# EAGLE design メイン回路２ (EAGLE 9.6.2)
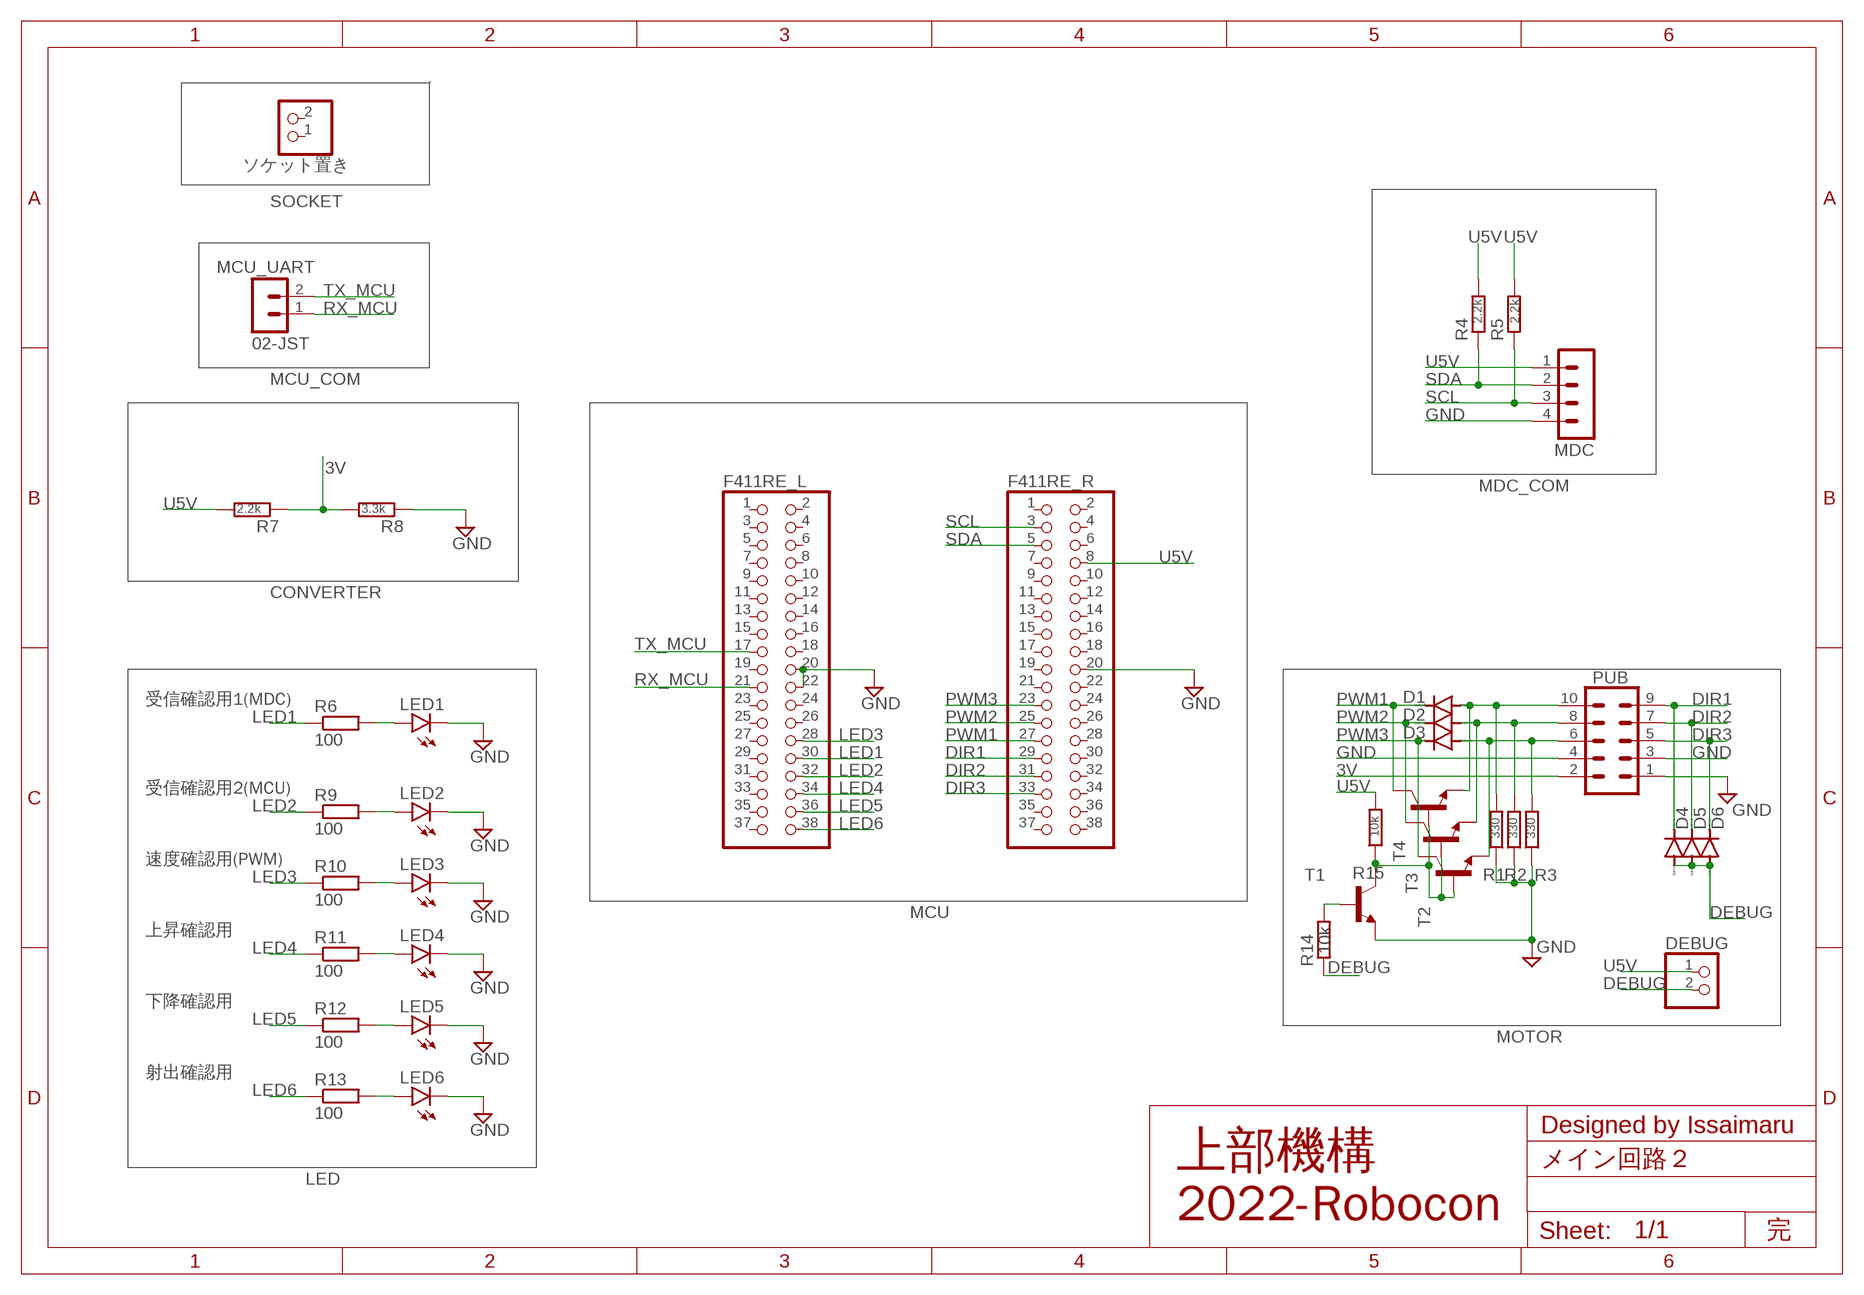
[diagram p0: schematic, sheet 1]

## Parts
D1  1N4004  [DO41-10]
D2  1N4004  [DO41-10]
D3  1N4004  [DO41-10]
D4  1N4004  [DO41-10]
D5  1N4004  [DO41-10]
D6  1N4004  [DO41-10]
DEBUG  PINHD-1X2  [1X02]
F411RE_L  PINHD-2X19  [2X19]
F411RE_R  PINHD-2X19  [2X19]
LED1  LED5MM  [LED5MM]
LED2  LED5MM  [LED5MM]
LED3  LED5MM  [LED5MM]
LED4  LED5MM  [LED5MM]
LED5  LED5MM  [LED5MM]
LED6  LED5MM  [LED5MM]
MCU_UART  02-JST  [B2B-XH]
MDC  04-JST  [B4B-XH]
PUB  ML10  [ML10]
R1  330  R-EU_0204/7  [0204/7]
R2  330  R-EU_0204/7  [0204/7]
R3  330  R-EU_0204/7  [0204/7]
R4  2.2k  R-EU_0204/7  [0204/7]
R5  2.2k  R-EU_0204/7  [0204/7]
R6  100  R-EU_0204/7  [0204/7]
R7  2.2k  R-EU_0204/7  [0204/7]
R8  3.3k  R-EU_0204/7  [0204/7]
R9  100  R-EU_0204/7  [0204/7]
R10  100  R-EU_0204/7  [0204/7]
R11  100  R-EU_0204/7  [0204/7]
R12  100  R-EU_0204/7  [0204/7]
R13  100  R-EU_0204/7  [0204/7]
R14  10k  R-EU_0204/7  [0204/7]
R15  10k  R-EU_0204/7  [0204/7]
T1  一般的なトランジスタ  [TO92-CEB]
T2  一般的なトランジスタ  [TO92-CEB]
T3  一般的なトランジスタ  [TO92-CEB]
T4  一般的なトランジスタ  [TO92-CEB]
ソケット置き  PINHD-1X2  [1X02]

## Nets
3V: PUB.2 R7.1 R8.2
DEBUG: D4.A D5.A D6.A DEBUG.2 R14.1
DIR1: D4.C F411RE_R.29 PUB.9
DIR2: D5.C F411RE_R.31 PUB.7
DIR3: D6.C F411RE_R.33 PUB.5
GND: F411RE_L.20 F411RE_L.22 F411RE_R.20 LED1.K(C) LED2.K(C) LED3.K(C) LED4.K(C) LED5.K(C) LED6.K(C) MDC.4 PUB.1 PUB.3 PUB.4 R1.1 R2.1 R3.1 R8.1 T1.E
LED1: F411RE_L.30 R6.1
LED2: F411RE_L.32 R9.1
LED3: F411RE_L.28 R10.1
LED4: F411RE_L.34 R11.1
LED5: F411RE_L.36 R12.1
LED6: F411RE_L.38 R13.1
N$1: LED2.A R9.2
N$2: LED1.A R6.2
N$3: LED3.A R10.2
N$4: LED4.A R11.2
N$5: LED5.A R12.2
N$6: LED6.A R13.2
N$7: R14.2 T1.B
N$8: D1.A PUB.10 R1.2 T4.E
N$9: D2.A PUB.8 R2.2 T3.E
N$Q0: D3.A PUB.6 R3.2 T2.E
PWM1: D1.C F411RE_R.27 T4.C
PWM2: D2.C F411RE_R.25 T3.C
PWM3: D3.C F411RE_R.23 T2.C
RX_MCU: F411RE_L.21 MCU_UART.1
SCL: F411RE_R.3 MDC.3 R5.1
SDA: F411RE_R.5 MDC.2 R4.1
TX_MCU: F411RE_L.17 MCU_UART.2
U5V: DEBUG.1 F411RE_R.8 MDC.1 R4.2 R5.2 R7.2 R15.2
ZM: R15.1 T1.C T2.B T3.B T4.B
Unconnected: F411RE_L.1 F411RE_L.2 F411RE_L.3 F411RE_L.4 F411RE_L.5 F411RE_L.6 F411RE_L.7 F411RE_L.8 F411RE_L.9 F411RE_L.10 F411RE_L.11 F411RE_L.12 F411RE_L.13 F411RE_L.14 F411RE_L.15 F411RE_L.16 F411RE_L.18 F411RE_L.19 F411RE_L.23 F411RE_L.24 F411RE_L.25 F411RE_L.26 F411RE_L.27 F411RE_L.29 F411RE_L.31 F411RE_L.33 F411RE_L.35 F411RE_L.37 F411RE_R.1 F411RE_R.2 F411RE_R.4 F411RE_R.6 F411RE_R.7 F411RE_R.9 F411RE_R.10 F411RE_R.11 F411RE_R.12 F411RE_R.13 F411RE_R.14 F411RE_R.15 F411RE_R.16 F411RE_R.17 F411RE_R.18 F411RE_R.19 F411RE_R.21 F411RE_R.22 F411RE_R.24 F411RE_R.26 F411RE_R.28 F411RE_R.30 F411RE_R.32 F411RE_R.34 F411RE_R.35 F411RE_R.36 F411RE_R.37 F411RE_R.38 ソケット置き.1 ソケット置き.2

## Notes on the sheet
- SOCKET
- MCU_COM
- MDC_COM
- CONVERTER
- 受信確認用1(MDC)
- 受信確認用2(MCU)
- 速度確認用(PWM)
- MCU
- 上昇確認用
- 下降確認用
- MOTOR
- 射出確認用
- Designed by Issaimaru
- LED
- 上部機構
  2022-Robocon
- 完

## Library data of the parts
D1-D6 = diode:1N4004: DIODE general purpose rectifier, 1 A
DEBUG ソケット置き = pinhead:PINHD-1X2: PIN HEADER
F411RE_L F411RE_R = pinhead:PINHD-2X19: PIN HEADER
LED1-LED6 = led:LED: LED OSRAM: - CHIPLED LG R971, LG N971, LY N971, LG Q971, LY Q971, LO R971, LY R971 LH N974, LH R974 LS Q976, LO Q976, LY Q976 LO Q996 - Hyper CHIPLED LW Q18S LB Q993, LB Q99A, LB R99A - SideLED LS A670, LO A670, LY A670, LG A670, LP A670 LB A673, LV A673, LT A673, LW A673 LH A674 LY A675 LS A676, LA A676, LO A676, LY A676, LW A676 LS A679, LY A679, LG A679 - Hyper Micro SIDELED® LS Y876, LA Y876, LO Y876, LY Y876 LT Y87S - SmartLED LW L88C, LW L88S LB L89C, LB L89S, LG L890 LS L89K, LO L89K, LY L89K LS L896, LA L896, LO L896, LY L896 - TOPLED LS T670, LO T670, LY T670, LG T670, LP T670 LSG T670, LSP T670, LSY T670, LOP T670, LYG T670 LG T671, LOG T671, LSG T671 LB T673, LV T673, LT T673, LW T673 LH T674 LS T676, LA T676, LO T676, LY T676, LB T676, LH T676, LSB T676, LW T676 LB T67C, LV T67C, LT T67C, LS T67K, LO T67K, LY T67K, LW E67C LS E67B, LA E67B, LO E67B, LY E67B, LB E67C, LV E67C, LT E67C LW T67C LS T679, LY T679, LG T679 LS T770, LO T770, LY T770, LG T770, LP T770 LB T773, LV T773, LT T773, LW T773 LH T774 LS E675, LA E675, LY E675, LS T675 LS T776, LA T776, LO T776, LY T776, LB T776 LHGB T686 LT T68C, LB T68C - Hyper Mini TOPLED® LB M676 - Mini TOPLED Santana® LG M470 LS M47K, LO M47K, LY M47K Source: http://www.osram.convergy.de LUXEON: - LUMILED® LXK2-PW12-R00, LXK2-PW12-S00, LXK2-PW14-U00, LXK2-PW14-V00 LXK2-PM12-R00, LXK2-PM12-S00, LXK2-PM14-U00 LXK2-PE12-Q00, LXK2-PE12-R00, LXK2-PE12-S00, LXK2-PE14-T00, LXK2-PE14-U00 LXK2-PB12-K00, LXK2-PB12-L00, LXK2-PB12-M00, LXK2-PB14-N00, LXK2-PB14-P00, LXK2-PB14-Q00 LXK2-PR12-L00, LXK2-PR12-M00, LXK2-PR14-Q00, LXK2-PR14-R00 LXK2-PD12-Q00, LXK2-PD12-R00, LXK2-PD12-S00 LXK2-PH12-R00, LXK2-PH12-S00 LXK2-PL12-P00, LXK2-PL12-Q00, LXK2-PL12-R00 Source: www.luxeon.com KINGBRIGHT: KA-3528ASYC Source: www.kingbright.com
MCU_UART = con-jst-xh (1):02-JST: JST CONNECTOR
MDC = con-jst-xh:04-JST: JST CONNECTOR
PUB = con-ml:ML10: HARTING; OC_FARNELL: unknown; OC_NEWARK: unknown
R1-R15 = rcl:R-EU_: RESISTOR, European symbol; SPICEPREFIX: R
T1-T4 = 一般的なトランジスタ:一般的なトランジスタ

## Board
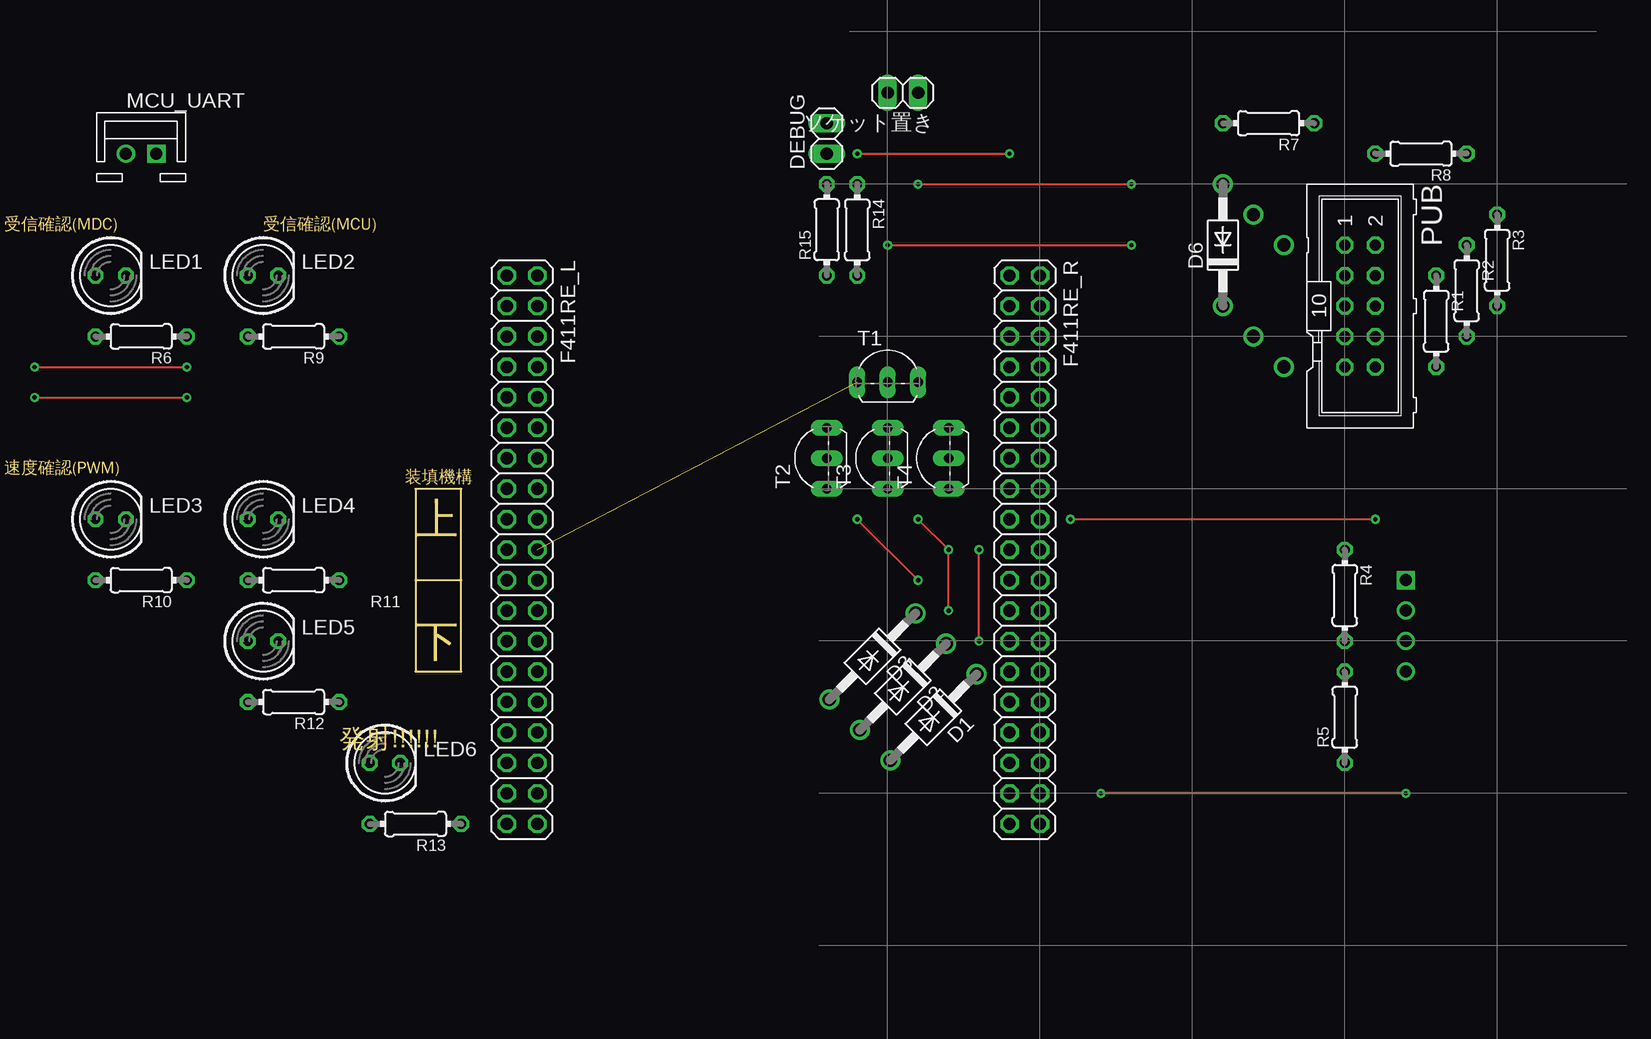
[diagram p1: board, top side]
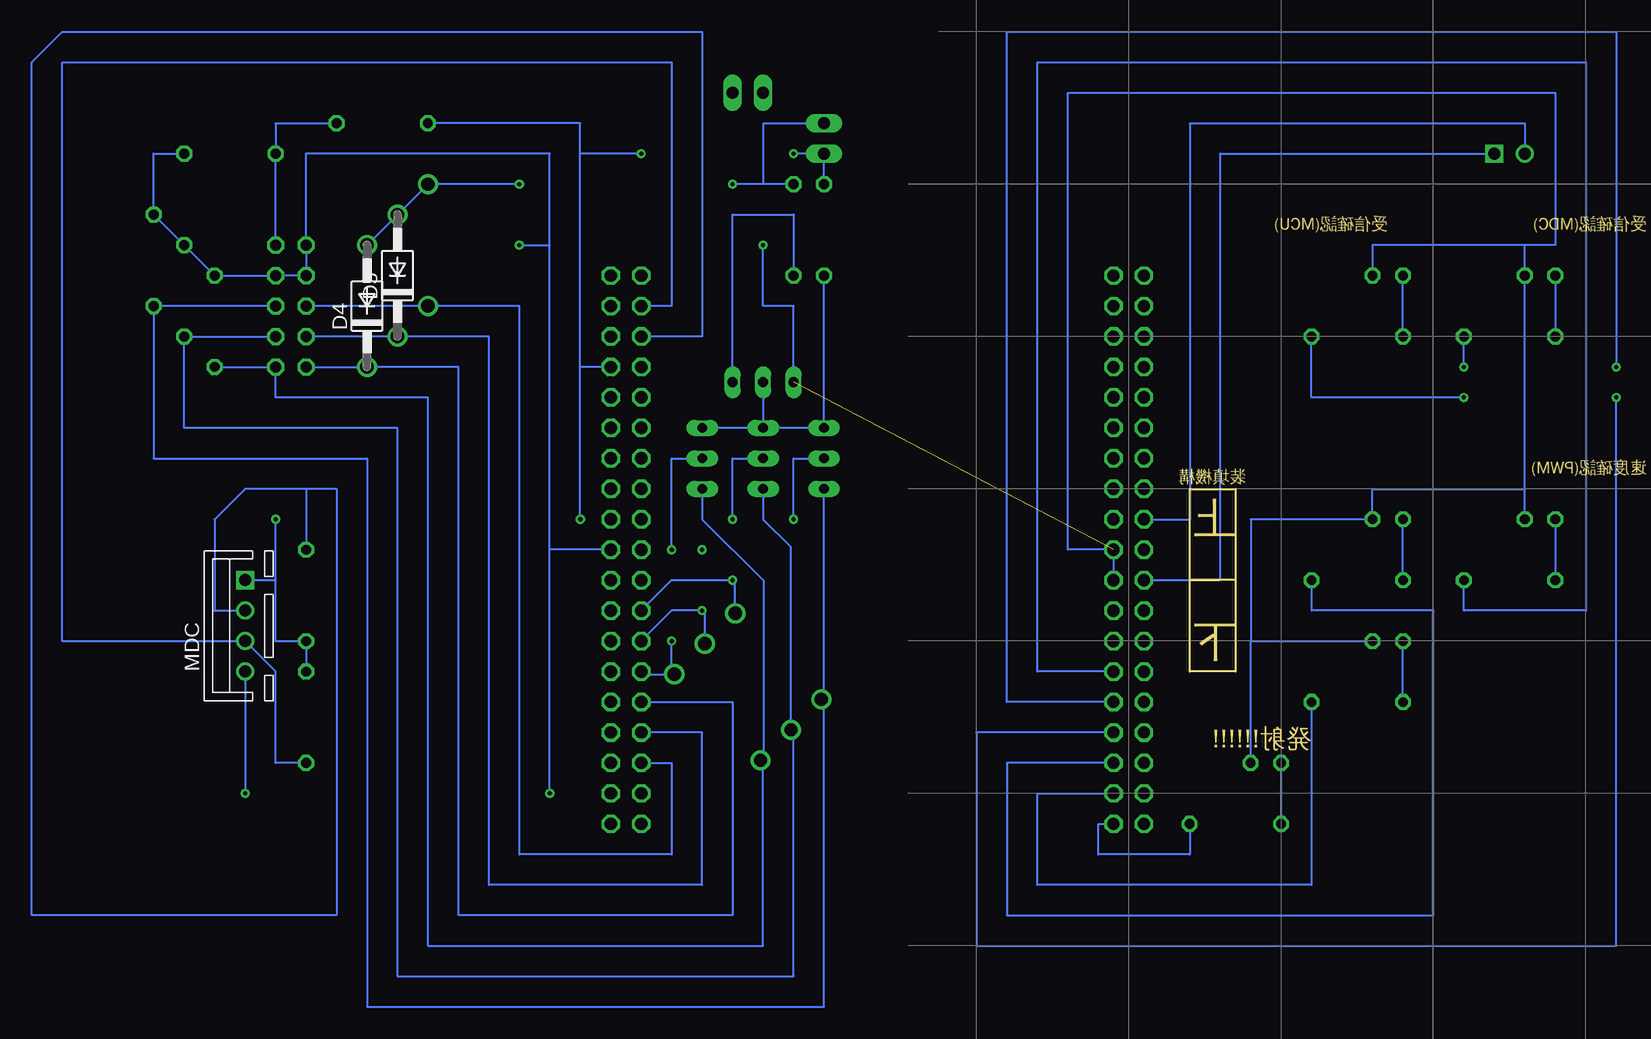
[diagram p2: board, bottom side, seen from below]

No outline drawn. Coordinates in mm, seen from the top.
Copper layers (1*16): Top 0.035mm / dielectric 1.5mm / Bottom 0.035mm
Design rules "default": minimum track width 6mil, minimum drill 0.35mm, track to track 6mil, track to pad 6mil, pad to pad 6mil, via to via 6mil, smd to smd 6mil, copper to edge 40mil, drill to drill 6mil, minimum pad ring 10mil, minimum via ring 8mil, stop-mask expansion 4mil, vias tented up to drill 0mil, thermal gap 10mil
Milling: 7 lines

### Footprints (pad centres in the part's own frame; a part is rotated, then mirrored left to right if it is on the bottom)
DO41-10 = drill 1.118: A 5.08,0; C -5.08,0
1X02 = drill 1.016 long: 1 -1.27,0; 2 1.27,0
2X19 = drill 1.016 octagon: 1 -22.86,-1.27; 2 -22.86,1.27; 3 -20.32,-1.27; 4 -20.32,1.27; 5 -17.78,-1.27; 6 -17.78,1.27; 7 -15.24,-1.27; 8 -15.24,1.27; 9 -12.7,-1.27; 10 -12.7,1.27; 11 -10.16,-1.27; 12 -10.16,1.27; 13 -7.62,-1.27; 14 -7.62,1.27; 15 -5.08,-1.27; 16 -5.08,1.27; 17 -2.54,-1.27; 18 -2.54,1.27; 19 0,-1.27; 20 0,1.27; 21 2.54,-1.27; 22 2.54,1.27; 23 5.08,-1.27; 24 5.08,1.27; 25 7.62,-1.27; 26 7.62,1.27; 27 10.16,-1.27; 28 10.16,1.27; 29 12.7,-1.27; 30 12.7,1.27; 31 15.24,-1.27; 32 15.24,1.27; 33 17.78,-1.27; 34 17.78,1.27; 35 20.32,-1.27; 36 20.32,1.27; 37 22.86,-1.27; 38 22.86,1.27
LED5MM = drill 0.813 octagon: A -1.27,0; K 1.27,0
B2B-XH = drill 1 square: 1 1.27,0 | drill 1: 2 -1.27,0
B4B-XH = drill 1 square: 1 3.81,0 | drill 1: 2 1.27,0; 3 -1.27,0; 4 -3.81,0
ML10 = drill 0.914 octagon: 1 -5.08,-1.27; 2 -5.08,1.27; 3 -2.54,-1.27; 4 -2.54,1.27; 5 0,-1.27; 6 0,1.27; 7 2.54,-1.27; 8 2.54,1.27; 9 5.08,-1.27; 10 5.08,1.27
0204/7 = drill 0.813 octagon: 1 -3.81,0; 2 3.81,0
TO92-CEB = drill 0.813 long: B 2.54,0; C 0,0; E -2.54,0

### Placement (x,y rotation side)
D1  72.39,12.7 225 top
D2  69.85,15.24 225 top
D3  67.31,17.78 225 top
D4  101.6,46.99 90 bottom
D5  99.06,49.53 90 bottom
D6  96.52,52.07 90 top
DEBUG  63.5,60.96 90 top
F411RE_L  38.1,26.67 270 top
F411RE_R  80.01,26.67 270 top
LED1  3.81,49.53 0 top
LED2  16.51,49.53 0 top
LED3  3.81,29.21 0 top
LED4  16.51,29.21 0 top
LED5  16.51,19.05 0 top
LED6  26.67,8.89 0 top
MCU_UART  6.35,59.69 0 top
MDC  111.76,20.32 90 bottom
PUB  107.95,46.99 270 top
R1  114.3,45.72 270 top
R2  116.84,48.26 270 top
R3  119.38,50.8 270 top
R4  106.68,22.86 270 top
R5  106.68,12.7 90 top
R6  6.35,44.45 180 top
R7  100.33,62.23 180 top
R8  113.03,59.69 180 top
R9  19.05,44.45 180 top
R10  6.35,24.13 180 top
R11  19.05,24.13 180 top
R12  19.05,13.97 180 top
R13  29.21,3.81 180 top
R14  66.04,53.34 270 top
R15  63.5,53.34 90 top
T1  68.58,40.64 0 top
T2  63.5,34.29 90 top
T3  68.58,34.29 90 top
T4  73.66,34.29 90 top
U$2  [TYPE.B]  132.08,-19.05 90 top
U$3  [TYPE.B]  -12.7,-19.05 90 bottom
ソケット置き  69.85,64.77 180 top

### Tracks (layer width: path | path; a pad name or v marks a point on that pad's centre or on a via)
3V
  Bottom 0.152: R7.1 109.22,62.23 R8.2 PUB.2
DEBUG  (via drill 0.35)
  Top 0.152: v71.12,57.15 v88.9,57.15
  Bottom 0.152: D4.A D5.A D6.A v88.9,57.15 | DEBUG.2 68.58,62.23 68.58,57.15 R14.1 v71.12,57.15
DIR1
  Bottom 0.152: F411RE_R.29 71.12,13.97 71.12,-3.81 93.98,-3.81 93.98,41.91 D4.C PUB.9
DIR2
  Bottom 0.152: F411RE_R.31 73.66,11.43 73.66,-1.27 91.44,-1.27 91.44,44.45 D5.C PUB.7
DIR3
  Bottom 0.152: F411RE_R.33 76.2,8.89 76.2,1.27 88.9,1.27 88.9,46.99 D6.C PUB.5
GND  (via drill 0.35)  (1 unrouted)
  Top 0.152: v111.76,6.35 v86.36,6.35 | v68.58,52.07 v88.9,52.07
  Bottom 0.152: 5.08,52.07 LED1.K 5.08,31.75 | 5.08,52.07 17.78,52.07 LED2.K | LED3.K 5.08,31.75 | LED6.K 27.94,19.05 | 27.94,19.05 LED5.K | 27.94,19.05 27.94,29.21 LED4.K 17.78,31.75 5.08,31.75 | 5.08,52.07 2.54,52.07 2.54,64.77 43.18,64.77 43.18,26.67 F411RE_L.20 F411RE_L.22 | F411RE_R.20 86.36,26.67 | MDC.4 v111.76,6.35 | v86.36,6.35 86.36,26.67 | 86.36,26.67 86.36,52.07 | 86.36,52.07 86.36,59.69 106.68,59.69 PUB.1 PUB.3 PUB.4 R1.1 R2.1 R3.1 119.38,59.69 R8.1 | T1.E 66.04,46.99 68.58,46.99 v68.58,52.07 | v88.9,52.07 86.36,52.07
LED1  (via drill 0.35)
  Top 0.152: v-2.54,41.91 v10.16,41.91
  Bottom 0.152: F411RE_L.30 48.26,13.97 48.26,69.85 -2.54,69.85 v-2.54,41.91 | v10.16,41.91 R6.1
LED2  (via drill 0.35)
  Top 0.152: v-2.54,39.37 v10.16,39.37
  Bottom 0.152: F411RE_L.32 50.8,11.43 50.8,-6.35 -2.54,-6.35 v-2.54,39.37 | v10.16,39.37 22.86,39.37 R9.1
LED3
  Bottom 0.152: F411RE_L.28 45.72,16.51 45.72,67.31 0,67.31 0,21.59 10.16,21.59 R10.1
LED4
  Bottom 0.152: F411RE_L.34 48.26,8.89 48.26,-3.81 12.7,-3.81 12.7,21.59 22.86,21.59 R11.1
LED5
  Bottom 0.152: R12.1 22.86,-1.27 45.72,-1.27 45.72,6.35 F411RE_L.36
LED6
  Bottom 0.152: R13.1 33.02,1.27 40.64,1.27 40.64,3.81 F411RE_L.38
N$1
  Bottom 0.152: R9.2 LED2.A
N$2
  Bottom 0.152: LED1.A R6.2
N$3
  Bottom 0.152: LED3.A R10.2
N$4
  Bottom 0.152: R11.2 LED4.A
N$5
  Bottom 0.152: R12.2 LED5.A
N$6
  Bottom 0.152: R13.2 LED6.A
N$7
  Bottom 0.152: T1.B 71.12,54.61 66.04,54.61 R14.2
N$8
  Bottom 0.152: R1.2 PUB.10 109.22,39.37 96.52,39.37 96.52,-6.35 68.58,-6.35 68.58,8.89 D1.A 68.54,9.36 68.54,24.09 73.66,29.21 T4.E
N$9
  Bottom 0.152: PUB.8 R2.2 116.84,36.83 99.06,36.83 99.06,-8.89 66.04,-8.89 66.04,11.43 D2.A 66.26,26.89 68.58,29.21 T3.E
N$Q0
  Bottom 0.152: PUB.6 R3.2 119.38,34.29 101.6,34.29 101.6,-11.43 63.5,-11.43 63.5,13.97 D3.A 63.5,14.41 T2.E
PWM1  (via drill 0.35)
  Top 0.152: v76.2,19.05 v76.2,26.67
  Bottom 0.152: F411RE_R.27 78.52,16.29 D1.C 76.2,16.51 v76.2,19.05 | v76.2,26.67 76.2,34.29 T4.C
PWM2  (via drill 0.35)
  Top 0.152: v73.66,21.59 v73.66,26.67 v71.12,29.21
  Bottom 0.152: 73.66,19.05 D2.C 73.44,21.37 v73.66,21.59 76.2,21.59 F411RE_R.25 | v71.12,29.21 71.12,34.29 T3.C
PWM3  (via drill 0.35)
  Top 0.152: v71.12,24.13 v66.04,29.21
  Bottom 0.152: 71.02,21.59 D3.C 70.9,23.91 v71.12,24.13 76.2,24.13 F411RE_R.23 | v66.04,29.21 66.04,34.29 T2.C
RX_MCU
  Bottom 0.152: F411RE_L.21 30.48,24.13 30.48,59.69 MCU_UART.1
SCL
  Bottom 0.152: R5.1 109.22,8.89 109.22,16.51 MDC.3 127,19.05 127,67.31 76.2,67.31 76.2,46.99 F411RE_R.3
SDA
  Bottom 0.152: MDC.2 114.3,21.59 114.3,29.21 111.76,31.75 106.68,31.75 | 106.68,31.75 R4.1 | F411RE_R.5 73.66,44.45 73.66,69.85 127,69.85 129.54,67.31 129.54,-3.81 104.14,-3.81 104.14,31.75 106.68,31.75
TX_MCU
  Bottom 0.152: F411RE_L.17 33.02,29.21 33.02,62.23 5.08,62.23 MCU_UART.2
U5V  (via drill 0.35)
  Top 0.152: v109.22,29.21 v83.82,29.21 | v66.04,59.69 v78.74,59.69
  Bottom 0.152: R5.2 R4.2 109.22,19.05 109.22,24.13 | MDC.1 109.22,24.13 | F411RE_R.8 83.82,41.91 | 83.82,41.91 83.82,59.69 | 83.82,59.69 83.82,62.23 R7.2 | 109.22,24.13 v109.22,29.21 | v83.82,29.21 83.82,41.91 | R15.2 DEBUG.1 v66.04,59.69 | v78.74,59.69 83.82,59.69
ZM
  Bottom 0.152: T3.B T2.B R15.1 | T3.B T4.B | T1.C T3.B

### Text on the board
tOrigins: はんだ付けの順番に注意!!
Milling: 受信確認(MDC) | 受信確認(MCU) | 速度確認(PWM) | 装填機構 | 上 | 下 | 発射!!!!!!